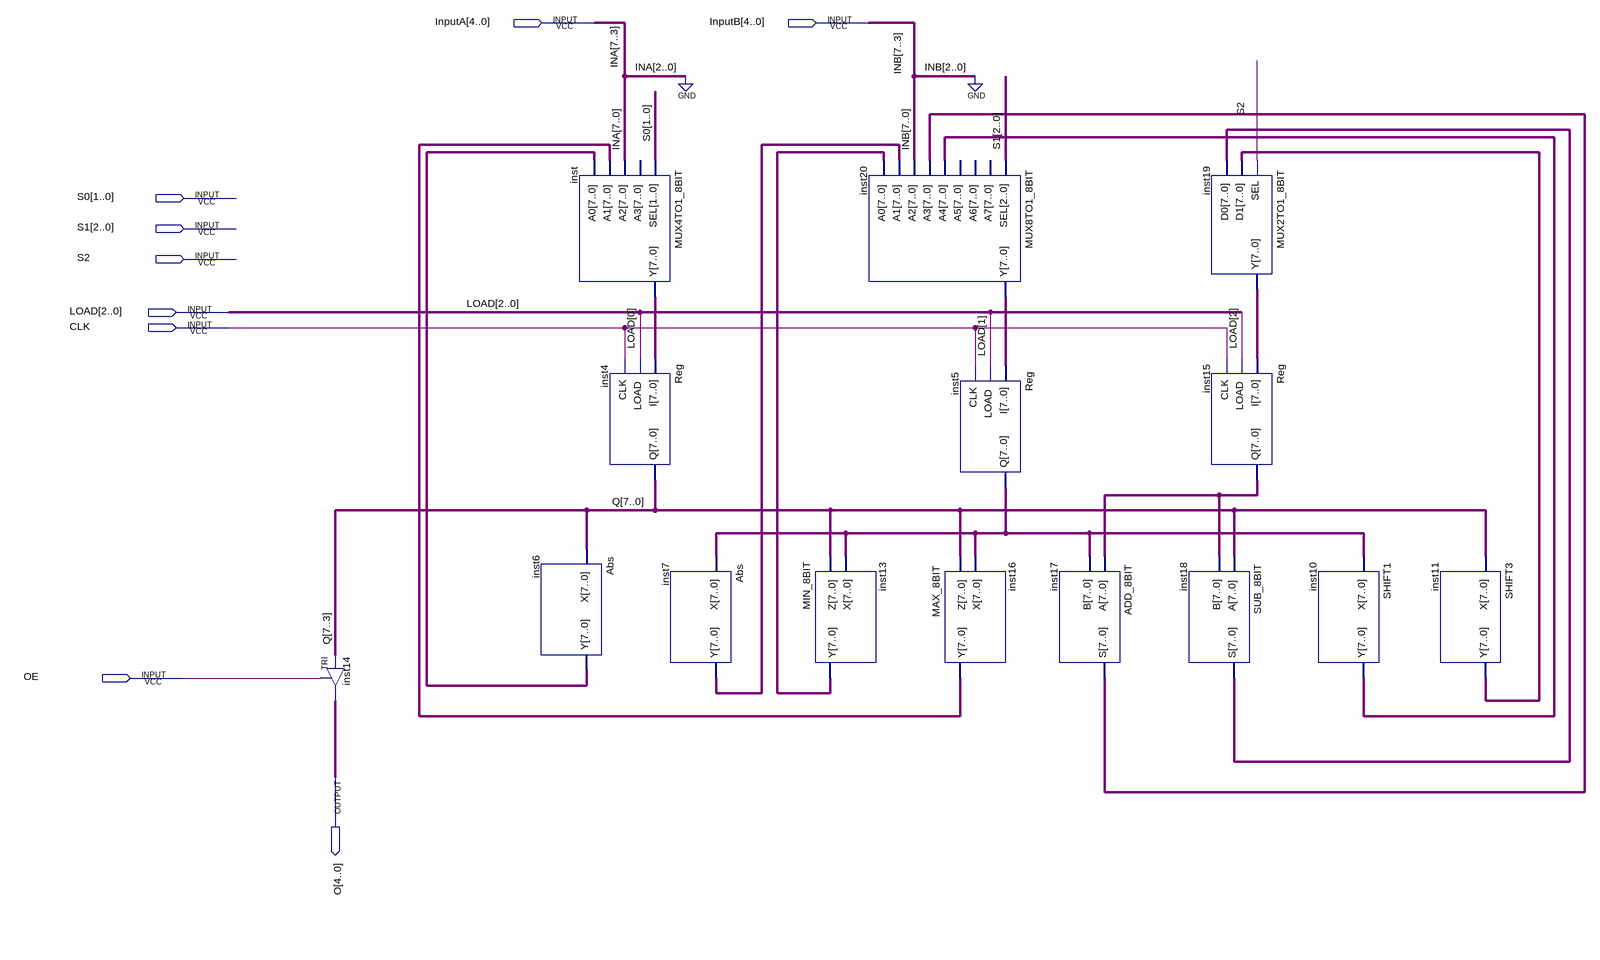
[diagram p0: schematic sheet]
// Quartus schematic datapath0.bdf as structural Verilog: 15 symbols, 9 pins
module datapath0 (
  input  [4:0] InputA,
  input  [4:0] InputB,
  input  [1:0] S0,
  input  [2:0] S1,
  input  S2,
  input  [2:0] LOAD,
  input  CLK,
  input  OE,
  output [4:0] O
);

  wire [7:0] inst5_q, inst6_y, inst7_y, inst10_y, inst11_y, inst13_y, inst15_q, inst16_y, inst17_s, inst18_s,
       inst19_y, inst20_y, inst_y, Q;

  TRI inst14[4:0] (.IN(Q[7:3]), .OE(OE), .OUT(O));
  MUX4TO1_8BIT inst (.SEL(S0), .A2({InputA, 3'b000}), .A1(inst16_y), .A0(inst6_y), .Y(inst_y));  // open: A3
  Abs inst6 (.X(Q), .Y(inst6_y));
  Reg inst4 (.I(inst_y), .LOAD(LOAD[0]), .CLK(CLK), .Q(Q));
  Abs inst7 (.X(inst5_q), .Y(inst7_y));
  MIN_8BIT inst13 (.Z(Q), .X(inst5_q), .Y(inst13_y));
  MUX8TO1_8BIT inst20 (
    .SEL(S1), .A4(inst10_y), .A3(inst17_s), .A2({InputB, 3'b000}), .A1(inst7_y), .A0(inst13_y), .Y(inst20_y));  // open: A7, A6, A5
  MAX_8BIT inst16 (.Z(Q), .X(inst5_q), .Y(inst16_y));
  Reg inst5 (.I(inst20_y), .LOAD(LOAD[1]), .CLK(CLK), .Q(inst5_q));
  ADD_8BIT inst17 (.A(inst15_q), .B(inst5_q), .S(inst17_s));
  SUB_8BIT inst18 (.A(Q), .B(inst15_q), .S(inst18_s));
  MUX2TO1_8BIT inst19 (.SEL(S2), .D1(inst11_y), .D0(inst18_s), .Y(inst19_y));
  Reg inst15 (.I(inst19_y), .LOAD(LOAD[2]), .CLK(CLK), .Q(inst15_q));
  SHIFT1 inst10 (.X(inst5_q), .Y(inst10_y));
  SHIFT3 inst11 (.X(Q), .Y(inst11_y));

  // Other names for the same wires on the sheet: INA[7:3] = InputA; INB[7:3] = InputB
endmodule
